# Altium schematic sheet FMC_LOOPBACK_HPC.SchDoc: Connector (HPC rows), Power pin LEDs
size A4; Date: 09.04.2019; DrawnBy: PFH; Engineer: PFH; DocumentNumber: 1; Revision: A; SheetNumber: 2; SheetTotal: 2; Projekt: FMC Loopback Module; Website: www.fmchub.com; ProjectName: FMC_Loopback
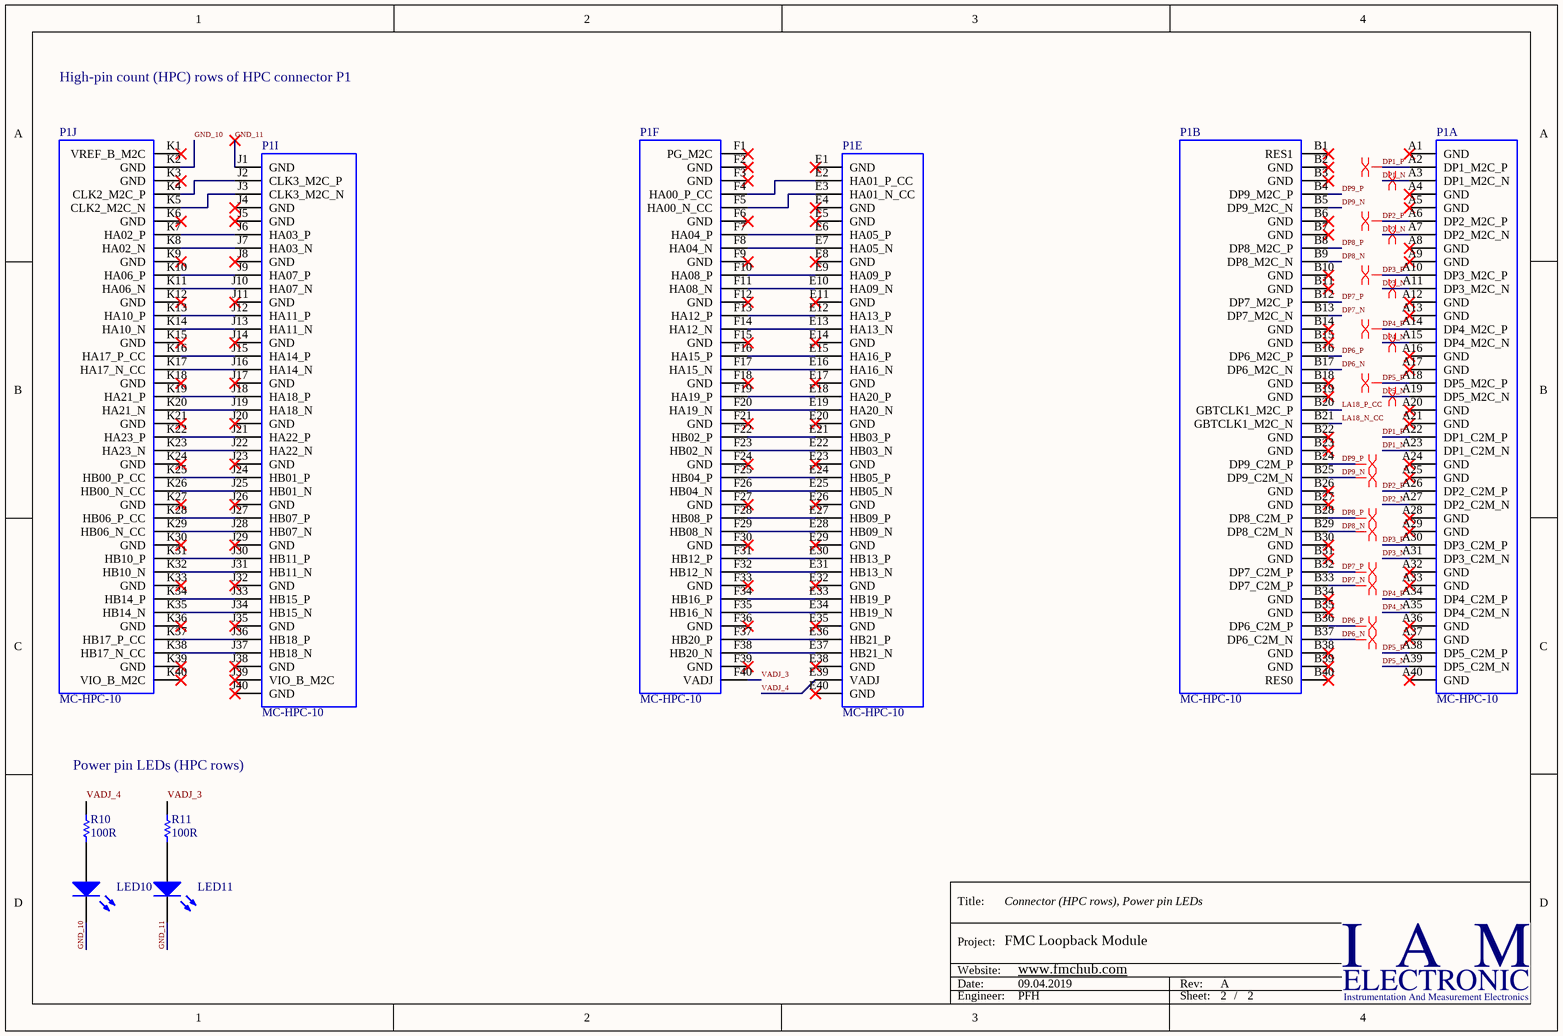
[diagram p0: FMC_LOOPBACK_HPC.SchDoc]

## Parts
LED10  150060GS75000  [0603_A]  (value not drawn)
LED11  150060GS75000  [0603_A]  (value not drawn)
P1  MC-HPC-10  [ASP-134488-01]  (parts A,B,E,F,I,J of 10)
R10  100R  [RESC0603(1608)_L]
R11  100R  [RESC0603(1608)_L]

## Nets
DP1_N: P1.A3(DP1_M2C_N) P1.A23(DP1_C2M_N)
DP1_P: P1.A2(DP1_M2C_P) P1.A22(DP1_C2M_P)
DP2_N: P1.A7(DP2_M2C_N) P1.A27(DP2_C2M_N)
DP2_P: P1.A6(DP2_M2C_P) P1.A26(DP2_C2M_P)
DP3_N: P1.A11(DP3_M2C_N) P1.A31(DP3_C2M_N)
DP3_P: P1.A10(DP3_M2C_P) P1.A30(DP3_C2M_P)
DP4_N: P1.A15(DP4_M2C_N) P1.A35(DP4_C2M_N)
DP4_P: P1.A14(DP4_M2C_P) P1.A34(DP4_C2M_P)
DP5_N: P1.A19(DP5_M2C_N) P1.A39(DP5_C2M_N)
DP5_P: P1.A18(DP5_M2C_P) P1.A38(DP5_C2M_P)
DP6_N: P1.B17(DP6_M2C_N) P1.B37(DP6_C2M_N)
DP6_P: P1.B16(DP6_M2C_P) P1.B36(DP6_C2M_P)
DP7_N: P1.B13(DP7_M2C_N) P1.B33(DP7_C2M_P)
DP7_P: P1.B12(DP7_M2C_P) P1.B32(DP7_C2M_P)
DP8_N: P1.B9(DP8_M2C_N) P1.B29(DP8_C2M_N)
DP8_P: P1.B8(DP8_M2C_P) P1.B28(DP8_C2M_P)
DP9_N: P1.B5(DP9_M2C_N) P1.B25(DP9_C2M_N)
DP9_P: P1.B4(DP9_M2C_P) P1.B24(DP9_C2M_P)
GND_10: LED10.1(K) P1.K2(GND)
GND_11: LED11.1(K) P1.J1(GND)
LA18_N_CC: P1.B21(GBTCLK1_M2C_N)
LA18_P_CC: P1.B20(GBTCLK1_M2C_P)
VADJ_3: P1.F40(VADJ) R11.2
VADJ_4: P1.E39(VADJ) R10.2
NetLED10_2: LED10.2(A) R10.1
NetLED11_2: LED11.2(A) R11.1
NetP1_E2: P1.E2(HA01_P_CC) P1.F4(HA00_P_CC)
NetP1_E3: P1.E3(HA01_N_CC) P1.F5(HA00_N_CC)
NetP1_E6: P1.E6(HA05_P) P1.F7(HA04_P)
NetP1_E7: P1.E7(HA05_N) P1.F8(HA04_N)
NetP1_E9: P1.E9(HA09_P) P1.F10(HA08_P)
NetP1_E10: P1.E10(HA09_N) P1.F11(HA08_N)
NetP1_E12: P1.E12(HA13_P) P1.F13(HA12_P)
NetP1_E13: P1.E13(HA13_N) P1.F14(HA12_N)
NetP1_E15: P1.E15(HA16_P) P1.F16(HA15_P)
NetP1_E16: P1.E16(HA16_N) P1.F17(HA15_N)
NetP1_E18: P1.E18(HA20_P) P1.F19(HA19_P)
NetP1_E19: P1.E19(HA20_N) P1.F20(HA19_N)
NetP1_E21: P1.E21(HB03_P) P1.F22(HB02_P)
NetP1_E22: P1.E22(HB03_N) P1.F23(HB02_N)
NetP1_E24: P1.E24(HB05_P) P1.F25(HB04_P)
NetP1_E25: P1.E25(HB05_N) P1.F26(HB04_N)
NetP1_E27: P1.E27(HB09_P) P1.F28(HB08_P)
NetP1_E28: P1.E28(HB09_N) P1.F29(HB08_N)
NetP1_E30: P1.E30(HB13_P) P1.F31(HB12_P)
NetP1_E31: P1.E31(HB13_N) P1.F32(HB12_N)
NetP1_E33: P1.E33(HB19_P) P1.F34(HB16_P)
NetP1_E34: P1.E34(HB19_N) P1.F35(HB16_N)
NetP1_E36: P1.E36(HB21_P) P1.F37(HB20_P)
NetP1_E37: P1.E37(HB21_N) P1.F38(HB20_N)
NetP1_J2: P1.J2(CLK3_M2C_P) P1.K4(CLK2_M2C_P)
NetP1_J3: P1.J3(CLK3_M2C_N) P1.K5(CLK2_M2C_N)
NetP1_J6: P1.J6(HA03_P) P1.K7(HA02_P)
NetP1_J7: P1.J7(HA03_N) P1.K8(HA02_N)
NetP1_J9: P1.J9(HA07_P) P1.K10(HA06_P)
NetP1_J10: P1.J10(HA07_N) P1.K11(HA06_N)
NetP1_J12: P1.J12(HA11_P) P1.K13(HA10_P)
NetP1_J13: P1.J13(HA11_N) P1.K14(HA10_N)
NetP1_J15: P1.J15(HA14_P) P1.K16(HA17_P_CC)
NetP1_J16: P1.J16(HA14_N) P1.K17(HA17_N_CC)
NetP1_J18: P1.J18(HA18_P) P1.K19(HA21_P)
NetP1_J19: P1.J19(HA18_N) P1.K20(HA21_N)
NetP1_J21: P1.J21(HA22_P) P1.K22(HA23_P)
NetP1_J22: P1.J22(HA22_N) P1.K23(HA23_N)
NetP1_J24: P1.J24(HB01_P) P1.K25(HB00_P_CC)
NetP1_J25: P1.J25(HB01_N) P1.K26(HB00_N_CC)
NetP1_J27: P1.J27(HB07_P) P1.K28(HB06_P_CC)
NetP1_J28: P1.J28(HB07_N) P1.K29(HB06_N_CC)
NetP1_J30: P1.J30(HB11_P) P1.K31(HB10_P)
NetP1_J31: P1.J31(HB11_N) P1.K32(HB10_N)
NetP1_J33: P1.J33(HB15_P) P1.K34(HB14_P)
NetP1_J34: P1.J34(HB15_N) P1.K35(HB14_N)
NetP1_J36: P1.J36(HB18_P) P1.K37(HB17_P_CC)
NetP1_J37: P1.J37(HB18_N) P1.K38(HB17_N_CC)

Not connected (* = marked no-connect by the designer): P1 A1(GND)* A4(GND)* A5(GND)* A8(GND)* A9(GND)* A12(GND)* A13(GND)* A16(GND)* A17(GND)* A20(GND)* A21(GND)* A24(GND)* A25(GND)* A28(GND)* A29(GND)* A32(GND)* A33(GND)* A36(GND)* A37(GND)* A40(GND)* B1(RES1)* B2(GND)* B3(GND)* B6(GND)* B7(GND)* B10(GND)* B11(GND)* B14(GND)* B15(GND)* B18(GND)* B19(GND)* B22(GND)* B23(GND)* B26(GND)* B27(GND)* B30(GND)* B31(GND)* B34(GND)* B35(GND)* B38(GND)* B39(GND)* B40(RES0)* E1(GND)* E4(GND)* E5(GND)* E8(GND)* E11(GND)* E14(GND)* E17(GND)* E20(GND)* E23(GND)* E26(GND)* E29(GND)* E32(GND)* E35(GND)* E38(GND)* E40(GND)* F1(PG_M2C)* F2(GND)* F3(GND)* F6(GND)* F9(GND)* F12(GND)* F15(GND)* F18(GND)* F21(GND)* F24(GND)* F27(GND)* F30(GND)* F33(GND)* F36(GND)* F39(GND)* J4(GND)* J5(GND)* J8(GND)* J11(GND)* J14(GND)* J17(GND)* J20(GND)* J23(GND)* J26(GND)* J29(GND)* J32(GND)* J35(GND)* J38(GND)* J39(VIO_B_M2C)* J40(GND)* K1(VREF_B_M2C)* K3(GND)* K6(GND)* K9(GND)* K12(GND)* K15(GND)* K18(GND)* K21(GND)* K24(GND)* K27(GND)* K30(GND)* K33(GND)* K36(GND)* K39(GND)* K40(VIO_B_M2C)*

## Layout directives
differential pair: DP1_N, DP1_P, DP2_N, DP2_P, DP3_N, DP3_P, DP4_N, DP4_P, DP5_N, DP5_P, DP6_N, DP6_P, DP7_N, DP7_P, DP8_N, DP8_P, DP9_N, DP9_P

## Notes on the sheet
- High-pin count (HPC) rows of HPC connector P1
- Power pin LEDs (HPC rows)
- Title:
- Project:
- Date:
- Website:
- Rev:
- Engineer:
- Sheet:
- /

## Library data of the parts
LED10 LED11 = CMP-1426-00002-1: SMD mono-color Chip LED, WL-SMCW, Green; Manufacturer: Wuerth Elektronik; ComponentLink1URL: http://www.we-online.com; ComponentLink2Description: Datasheet; Color: Green; ComponentLink2URL: http://katalog.we-online.com/led/datasheet/150060GS75000.pdf; PartNumber: 150060GS75000; PackageReference: 0603_A; ComponentLink1Description: Manufacturer URL; Part: 150060GS75000
P1 = MC-HPC-10: MC-HPC-10, FMC High-pin count connector, lead free, 400 I/Os, male, 10 mm mated stack height; Manufacturer: Samtec; Manufacturer Ref: SEAM-40-03.5-S-10-2-A-K-TR-VITA57.0; Pitch: 1.27 mm; Mated Stack Height: 10 mm; Solder Type: Lead-Free; Number I/O: 400; PartName: ASP-134488-01; Part: ASP-134488-01; Vita PartNumber: MC-HPC-10; Pin Count: High; Gender: male; Supplier 1: Digi-Key; Supplier Part Number 1: SAM8730-ND
R10 R11 = CMP-1012-00050-1: 100R 0.1W 5% 0603 (1608 Metric)  SMD; Part: ERJ-3GEYJ101V; Manufacturer: Panasonic; Case-EIA: 0603; Value: 100.00 Ohm; Case-Metric: 1608; Tolerance: 5 %; Technology: SMT; Power: 0.1 W